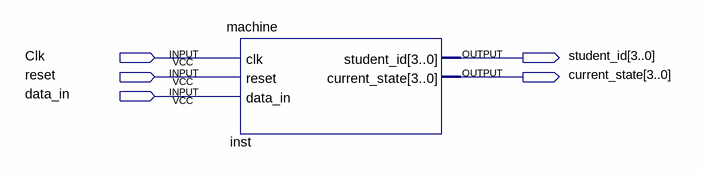
[diagram p0: schematic sheet]
// Quartus schematic FSMLab6.bdf as structural Verilog: 1 symbols, 5 pins
module FSMLab6 (
  input  Clk,
  input  reset,
  input  data_in,
  output [3:0] student_id,
  output [3:0] current_state
);

  machine inst (.clk(Clk), .reset(reset), .data_in(data_in), .student_id(student_id), .current_state(current_state));
endmodule
